# Altium schematic sheet RAM.SchDoc
size A4
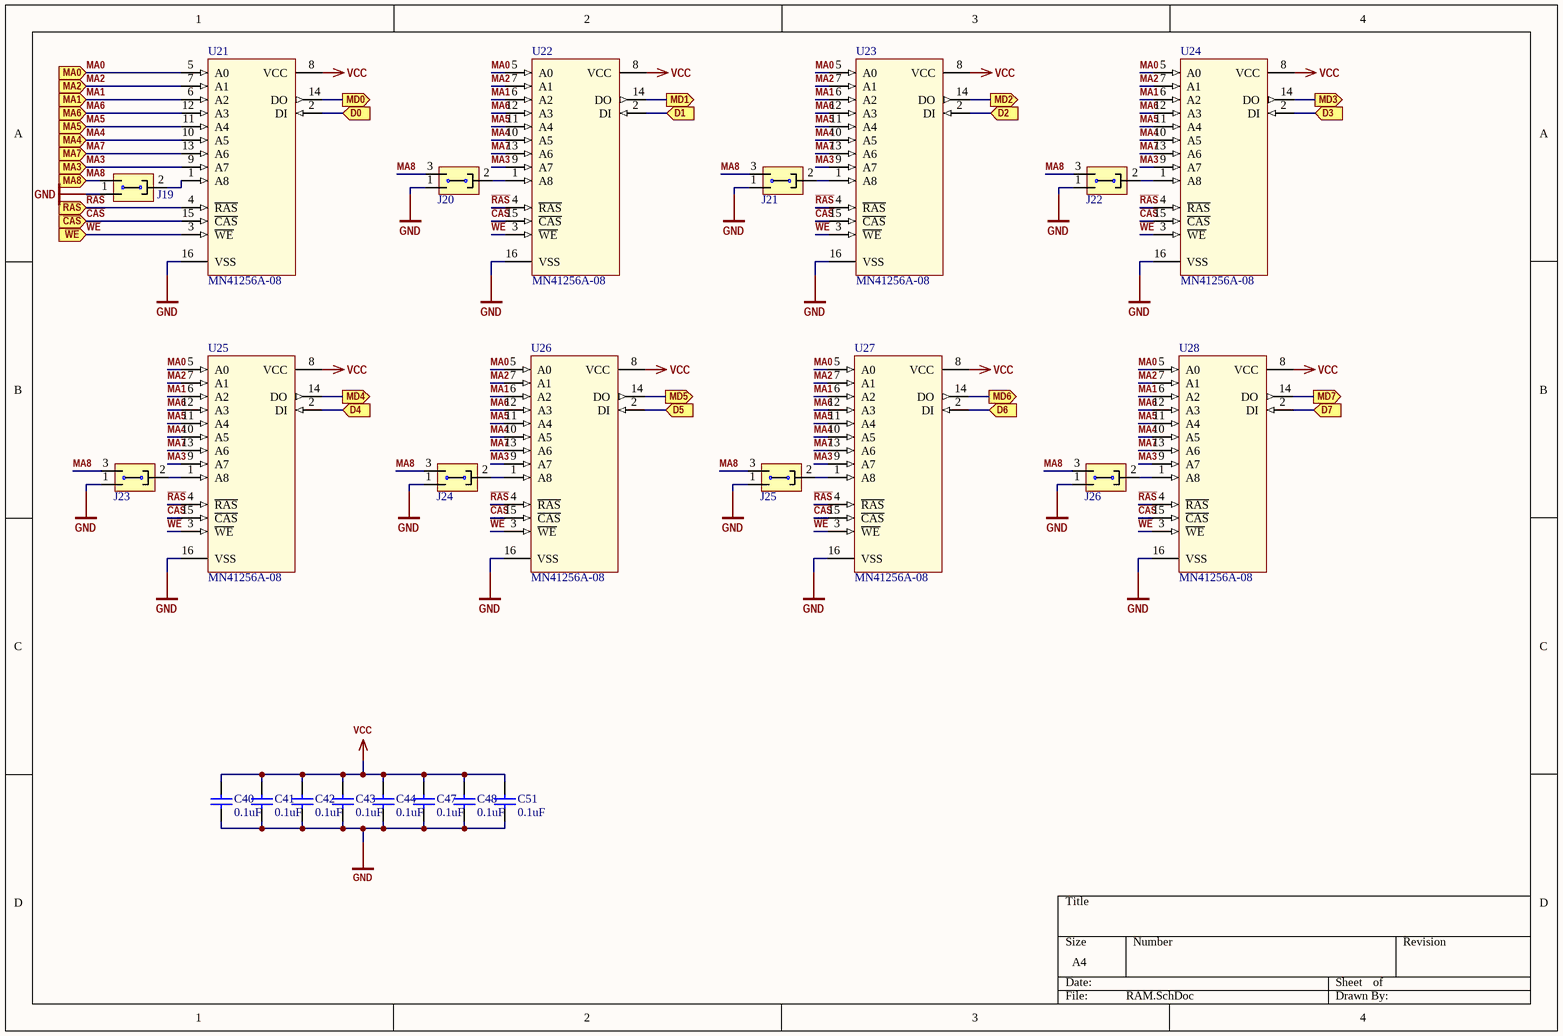
[diagram p0: RAM.SchDoc]

## Parts
C40  value 0.1uF  [RAD-0.3]  (hidden comment: Cap)
C41  value 0.1uF  [RAD-0.3]  (hidden comment: Cap)
C42  value 0.1uF  [RAD-0.3]  (hidden comment: Cap)
C43  value 0.1uF  [RAD-0.3]  (hidden comment: Cap)
C44  value 0.1uF  [RAD-0.3]  (hidden comment: Cap)
C47  value 0.1uF  [RAD-0.3]  (hidden comment: Cap)
C48  value 0.1uF  [RAD-0.3]  (hidden comment: Cap)
C51  value 0.1uF  [RAD-0.3]  (hidden comment: Cap)
J19  Jump3  [MHDR1X3]  (value not drawn)
J20  Jump3  [MHDR1X3]  (value not drawn)
J21  Jump3  [MHDR1X3]  (value not drawn)
J22  Jump3  [MHDR1X3]  (value not drawn)
J23  Jump3  [MHDR1X3]  (value not drawn)
J24  Jump3  [MHDR1X3]  (value not drawn)
J25  Jump3  [MHDR1X3]  (value not drawn)
J26  Jump3  [MHDR1X3]  (value not drawn)
U21  MN41256A-08  [DIP16]
U22  MN41256A-08  [DIP16]
U23  MN41256A-08  [DIP16]
U24  MN41256A-08  [DIP16]
U25  MN41256A-08  [DIP16]
U26  MN41256A-08  [DIP16]
U27  MN41256A-08  [DIP16]
U28  MN41256A-08  [DIP16]

## Ports
D0 (in), D1 (in), D2 (in), D3 (in), D4 (in), D5 (in), D6 (in), D7 (in), MA0 (in), MA1 (in), MA2 (in), MA3 (in), MA4 (in), MA5 (in), MA6 (in), MA7 (in), MA8 (in), MD0 (out), MD1 (out), MD2 (out), MD3 (out), MD4 (out), MD5 (out), MD6 (out), MD7 (out), ~{CAS} (in), ~{RAS} (in), ~{WE} (in)

## Nets
GND: C40.1 C41.1 C42.1 C43.1 C44.1 C47.1 C48.1 C51.1 J19.1 J20.1 J21.1 J22.1 J23.1 J24.1 J25.1 J26.1 U21.16(VSS) U22.16(VSS) U23.16(VSS) U24.16(VSS) U25.16(VSS) U26.16(VSS) U27.16(VSS) U28.16(VSS)
VCC: C40.2 C41.2 C42.2 C43.2 C44.2 C47.2 C48.2 C51.2 U21.8(VCC) U22.8(VCC) U23.8(VCC) U24.8(VCC) U25.8(VCC) U26.8(VCC) U27.8(VCC) U28.8(VCC)
~{CAS}: U21.15(~{CAS}) U22.15(~{CAS}) U23.15(~{CAS}) U24.15(~{CAS}) U25.15(~{CAS}) U26.15(~{CAS}) U27.15(~{CAS}) U28.15(~{CAS}) ; port ~{CAS}
D0: U21.2(DI) ; port D0
D1: U22.2(DI) ; port D1
D2: U23.2(DI) ; port D2
D3: U24.2(DI) ; port D3
D4: U25.2(DI) ; port D4
D5: U26.2(DI) ; port D5
D6: U27.2(DI) ; port D6
D7: U28.2(DI) ; port D7
MA0: U21.5(A0) U22.5(A0) U23.5(A0) U24.5(A0) U25.5(A0) U26.5(A0) U27.5(A0) U28.5(A0) ; port MA0
MA1: U21.6(A2) U22.6(A2) U23.6(A2) U24.6(A2) U25.6(A2) U26.6(A2) U27.6(A2) U28.6(A2) ; port MA1
MA2: U21.7(A1) U22.7(A1) U23.7(A1) U24.7(A1) U25.7(A1) U26.7(A1) U27.7(A1) U28.7(A1) ; port MA2
MA3: U21.9(A7) U22.9(A7) U23.9(A7) U24.9(A7) U25.9(A7) U26.9(A7) U27.9(A7) U28.9(A7) ; port MA3
MA4: U21.10(A5) U22.10(A5) U23.10(A5) U24.10(A5) U25.10(A5) U26.10(A5) U27.10(A5) U28.10(A5) ; port MA4
MA5: U21.11(A4) U22.11(A4) U23.11(A4) U24.11(A4) U25.11(A4) U26.11(A4) U27.11(A4) U28.11(A4) ; port MA5
MA6: U21.12(A3) U22.12(A3) U23.12(A3) U24.12(A3) U25.12(A3) U26.12(A3) U27.12(A3) U28.12(A3) ; port MA6
MA7: U21.13(A6) U22.13(A6) U23.13(A6) U24.13(A6) U25.13(A6) U26.13(A6) U27.13(A6) U28.13(A6) ; port MA7
MA8: J19.3 J20.3 J21.3 J22.3 J23.3 J24.3 J25.3 J26.3 ; port MA8
MD0: U21.14(DO) ; port MD0
MD1: U22.14(DO) ; port MD1
MD2: U23.14(DO) ; port MD2
MD3: U24.14(DO) ; port MD3
MD4: U25.14(DO) ; port MD4
MD5: U26.14(DO) ; port MD5
MD6: U27.14(DO) ; port MD6
MD7: U28.14(DO) ; port MD7
~{RAS}: U21.4(~{RAS}) U22.4(~{RAS}) U23.4(~{RAS}) U24.4(~{RAS}) U25.4(~{RAS}) U26.4(~{RAS}) U27.4(~{RAS}) U28.4(~{RAS}) ; port ~{RAS}
~{WE}: U21.3(~{WE}) U22.3(~{WE}) U23.3(~{WE}) U24.3(~{WE}) U25.3(~{WE}) U26.3(~{WE}) U27.3(~{WE}) U28.3(~{WE}) ; port ~{WE}
NetJ19_2: J19.2 U21.1(A8)
NetJ20_2: J20.2 U22.1(A8)
NetJ21_2: J21.2 U23.1(A8)
NetJ22_2: J22.2 U24.1(A8)
NetJ23_2: J23.2 U25.1(A8)
NetJ24_2: J24.2 U26.1(A8)
NetJ25_2: J25.2 U27.1(A8)
NetJ26_2: J26.2 U28.1(A8)

## Library data of the parts
C40-C44 C47 C48 C51 = Cap: Capacitor; Published: 8-Jun-2000; LatestRevisionDate: 17-Jul-2002; LatestRevisionNote: Re-released for DXP Platform.; PackageReference: RAD-0.3; Publisher: Altium Limited; PackageDescription: Radial Cap, Thru-Hole; 2 Leads; 0.3 in Pin Spacing